# Altium schematic sheet qse_blank.SchDoc
size Letter; SheetNumber: 4; SheetTotal: 9
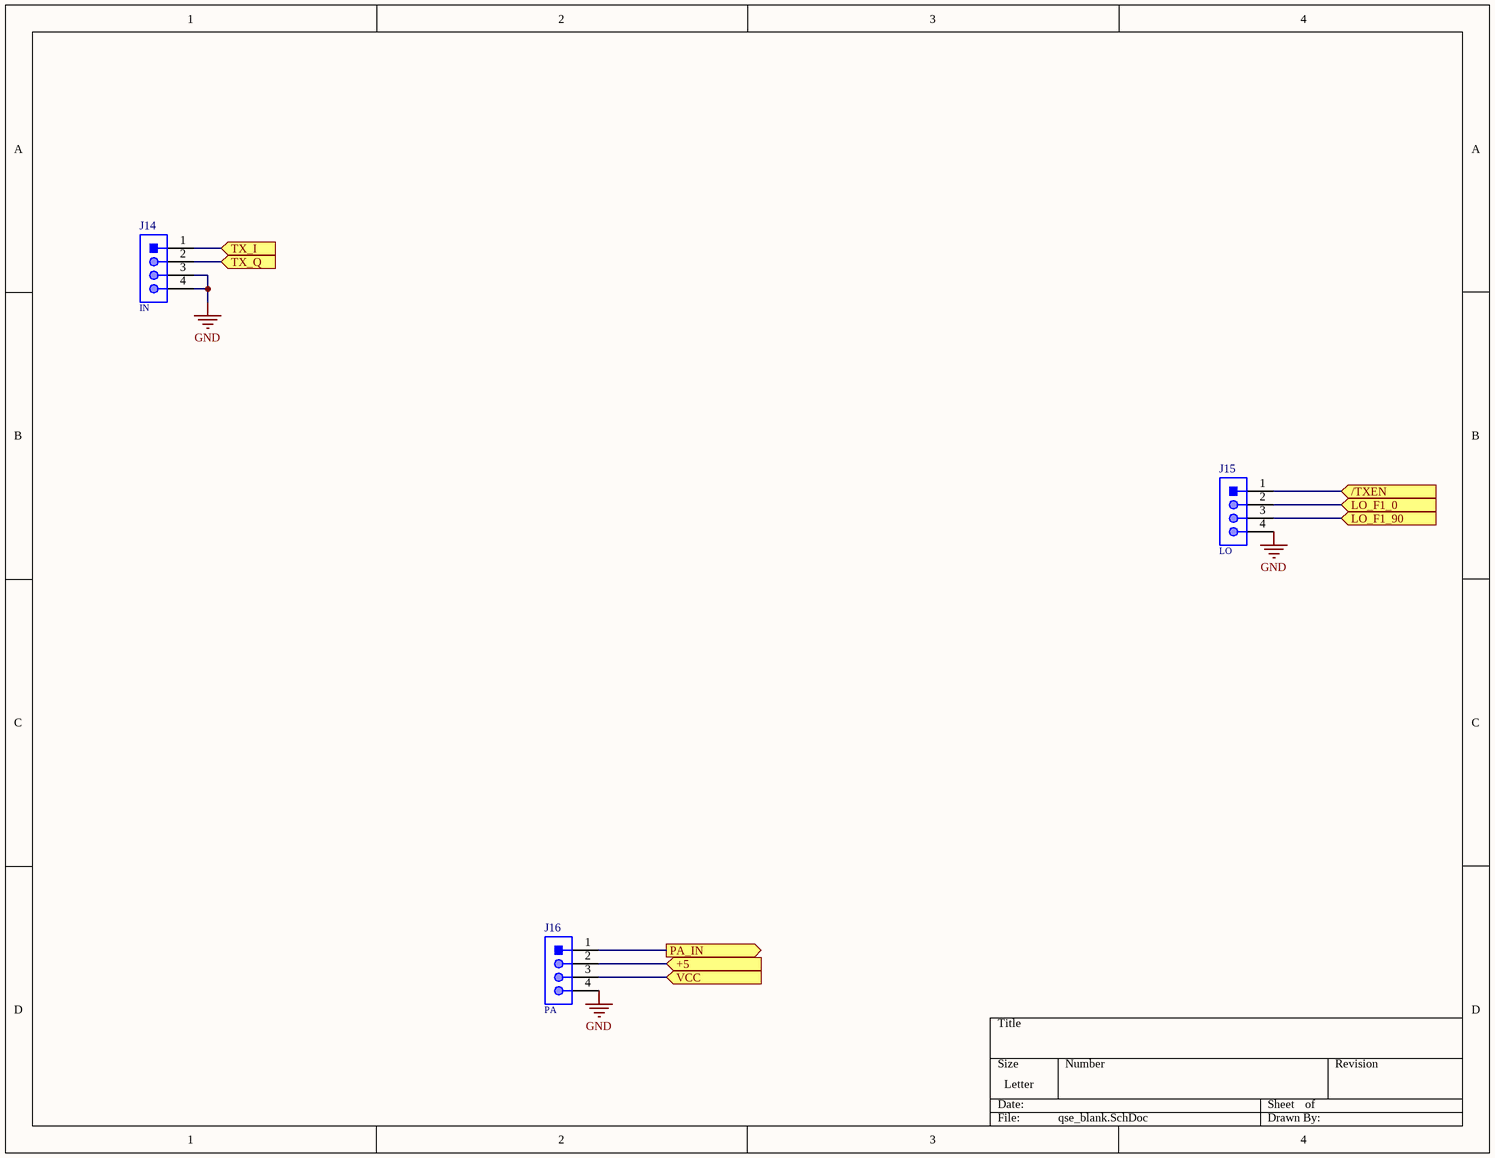
[diagram p0: qse_blank.SchDoc]

## Parts
J14  IN  [61300411121]
J15  LO  [61300411121]
J16  PA  [61300411121]

## Ports
+5 (in), /TXEN (in), LO_F1_0 (in), LO_F1_90 (in), PA_IN (out), TX_I (in), TX_Q (in), VCC (in)

## Nets
GND: J14.3 J14.4 J15.4 J16.4
+5: J16.2 ; port +5
/TXEN: J15.1 ; port /TXEN
LO_F1_0: J15.2 ; port LO_F1_0
LO_F1_90: J15.3 ; port LO_F1_90
PA_IN: J16.1 ; port PA_IN
TX_I: J14.1 ; port TX_I
TX_Q: J14.2 ; port TX_Q
VCC: J16.3 ; port VCC

## Library data of the parts
J14-J16 = CMP-1502-01064-1: THT Vertical Pin Header WR-PHD, Pitch 2.54 mm, Single Row, 4 pins; Manufacturer: Wurth Elektronik; Withstanding Voltage: 500VAC; Rated Current: 3A; Working Voltage: 250VAC; Pin Number: 4; Gender: Male; Contact Resistance: 20mOhm; Pitch: 2.54mm; Manufacturer URL: http://www.we-online.de; Operating Temperature: -40to105degC; Packaging: Bag; Mounting Technology: THT; Package Reference: 61300411121; Datasheet URL: https://katalog.we-online.de/em/datasheet/6130xx11121.pdf; Publisher: WurthElektronik; Part Number: 61300411121; Row Number: Single; Orientation: Vertical